# Altium schematic sheet motor.SchDoc
size A4
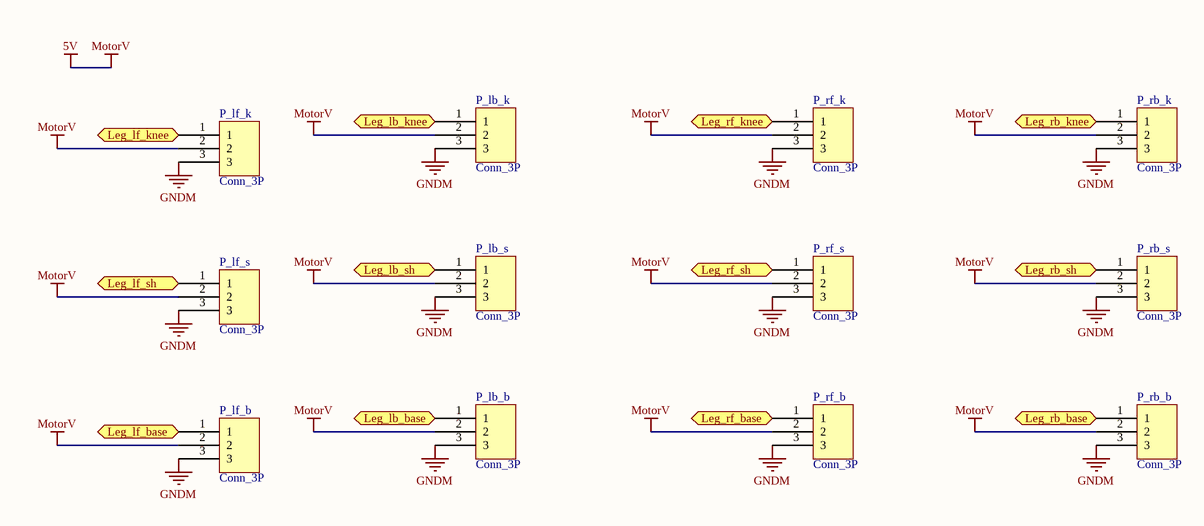
[diagram p0: motor.SchDoc]

## Parts
P_lb_b  Conn_3P  [3P_CONN_2mm]
P_lb_k  Conn_3P  [3P_CONN_2mm]
P_lb_s  Conn_3P  [3P_CONN_2mm]
P_lf_b  Conn_3P  [3P_CONN_2mm]
P_lf_k  Conn_3P  [3P_CONN_2mm]
P_lf_s  Conn_3P  [3P_CONN_2mm]
P_rb_b  Conn_3P  [3P_CONN_2mm]
P_rb_k  Conn_3P  [3P_CONN_2mm]
P_rb_s  Conn_3P  [3P_CONN_2mm]
P_rf_b  Conn_3P  [3P_CONN_2mm]
P_rf_k  Conn_3P  [3P_CONN_2mm]
P_rf_s  Conn_3P  [3P_CONN_2mm]

## Ports
Leg_lb_base, Leg_lb_knee, Leg_lb_sh, Leg_lf_base, Leg_lf_knee, Leg_lf_sh, Leg_rb_base, Leg_rb_knee, Leg_rb_sh, Leg_rf_base, Leg_rf_knee, Leg_rf_sh

## Nets
5V: P_lb_b.2 P_lb_k.2 P_lb_s.2 P_lf_b.2 P_lf_k.2 P_lf_s.2 P_rb_b.2 P_rb_k.2 P_rb_s.2 P_rf_b.2 P_rf_k.2 P_rf_s.2  [also labelled MotorV]
GNDM: P_lb_b.3 P_lb_k.3 P_lb_s.3 P_lf_b.3 P_lf_k.3 P_lf_s.3 P_rb_b.3 P_rb_k.3 P_rb_s.3 P_rf_b.3 P_rf_k.3 P_rf_s.3
Leg_lb_base: P_lb_b.1 ; port Leg_lb_base
Leg_lb_knee: P_lb_k.1 ; port Leg_lb_knee
Leg_lb_sh: P_lb_s.1 ; port Leg_lb_sh
Leg_lf_base: P_lf_b.1 ; port Leg_lf_base
Leg_lf_knee: P_lf_k.1 ; port Leg_lf_knee
Leg_lf_sh: P_lf_s.1 ; port Leg_lf_sh
Leg_rb_base: P_rb_b.1 ; port Leg_rb_base
Leg_rb_knee: P_rb_k.1 ; port Leg_rb_knee
Leg_rb_sh: P_rb_s.1 ; port Leg_rb_sh
Leg_rf_base: P_rf_b.1 ; port Leg_rf_base
Leg_rf_knee: P_rf_k.1 ; port Leg_rf_knee
Leg_rf_sh: P_rf_s.1 ; port Leg_rf_sh

## Library data of the parts
P_lb_b P_lb_k P_lb_s P_lf_b P_lf_k P_lf_s P_rb_b P_rb_k P_rb_s P_rf_b P_rf_k P_rf_s = Conn_3P: Name: TÁPCSATL. 2.00mm 3P APA 180° NCW200-03S (G-S) FORR.; Supplier: Lomex; Reference: 43-16-04